# EAGLE design labwiz-module_servo_dual (EAGLE 6.5.0)

## Sheet 1 of 2
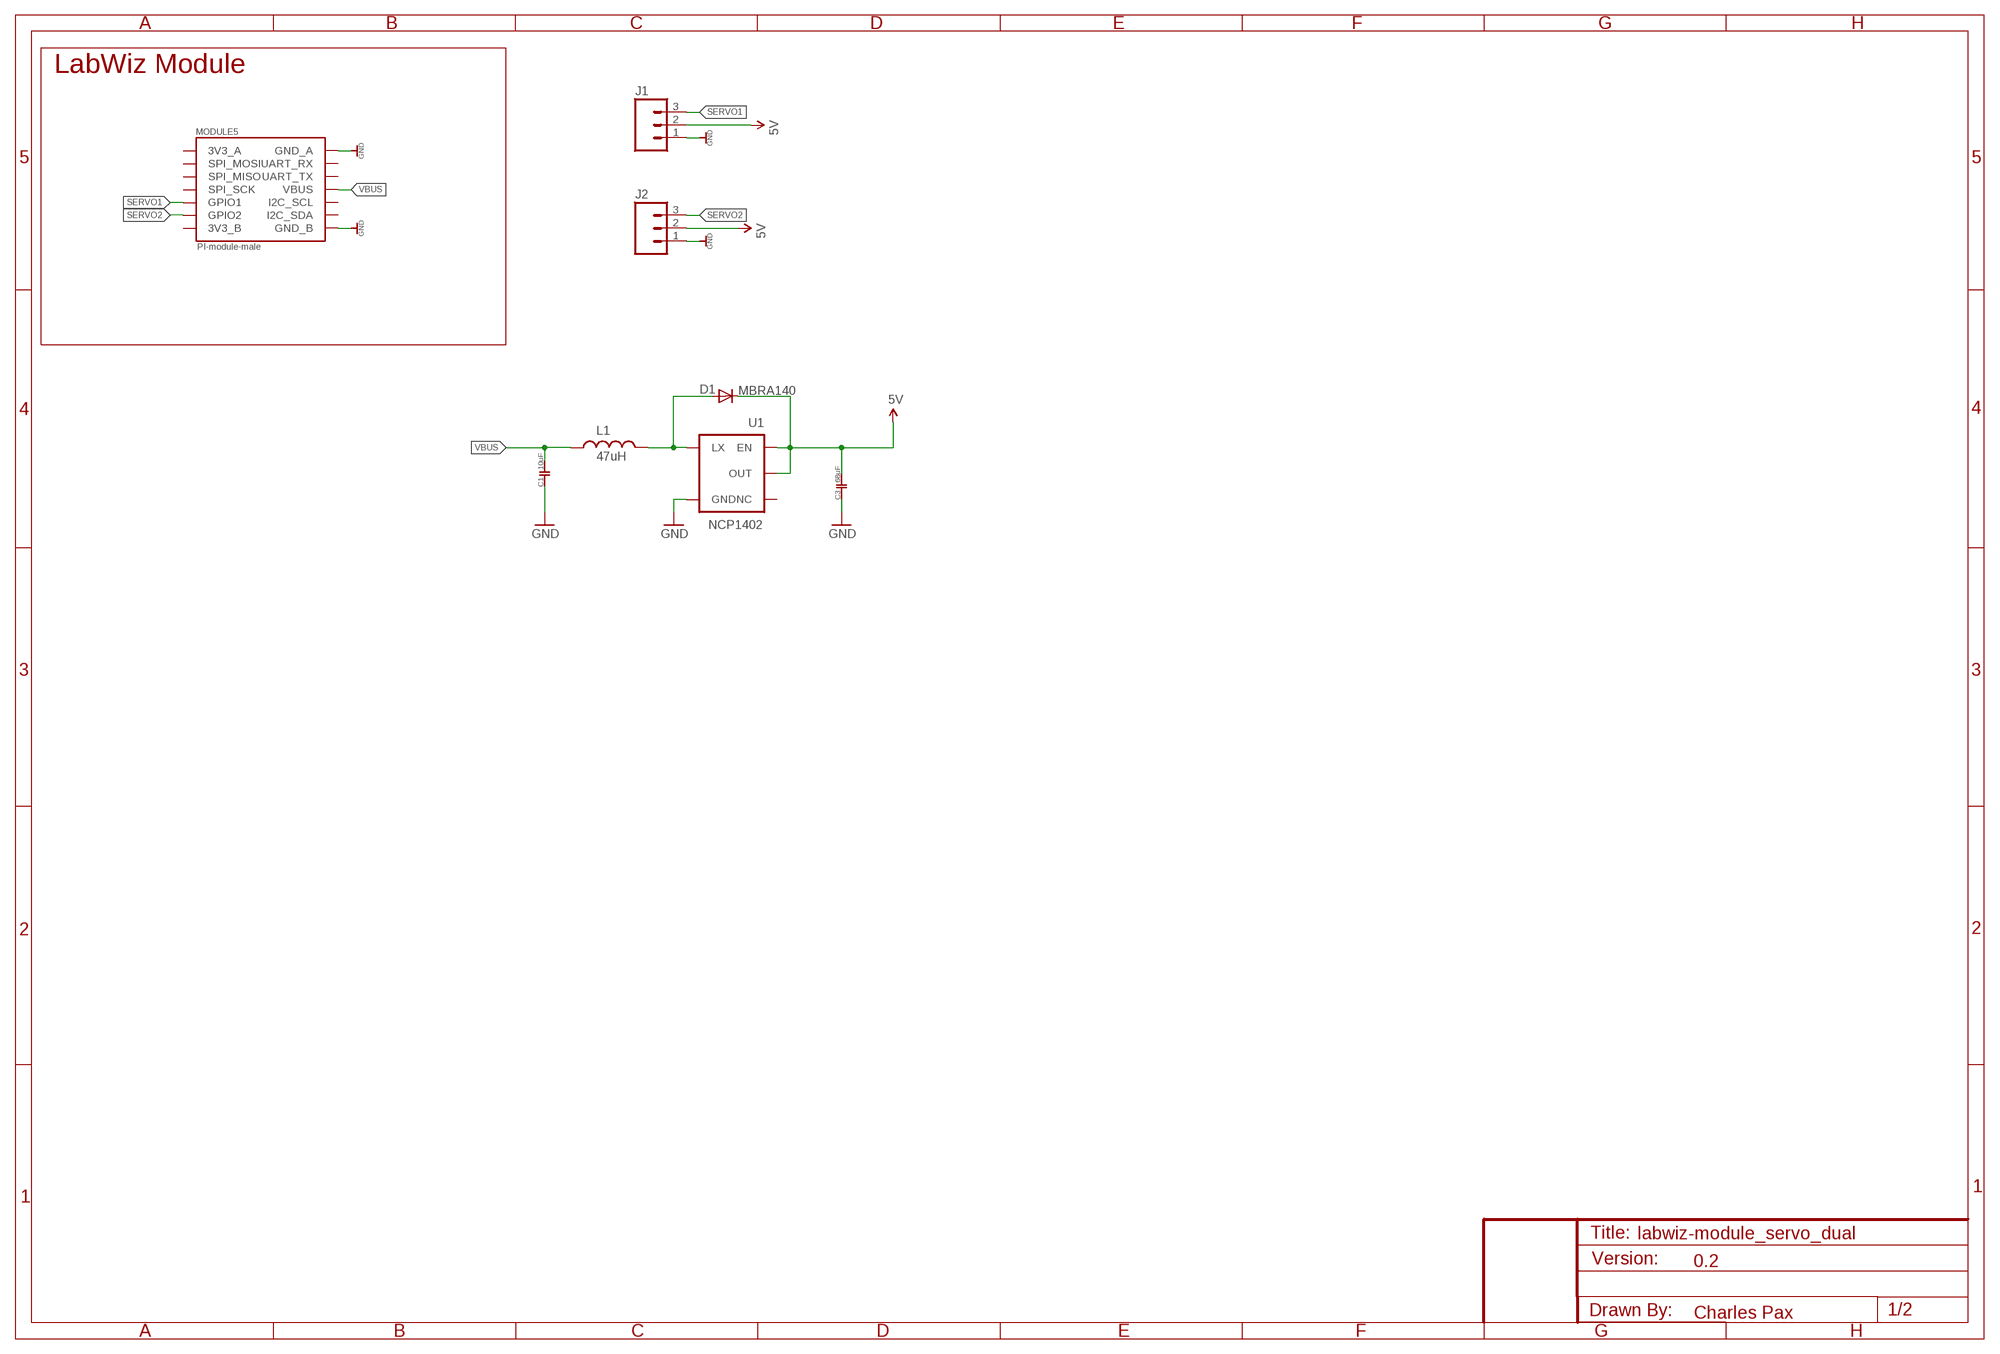
[diagram p0: schematic, sheet 1]

### Parts
C1  10uF  CAPACITOR_FIXED_10UF_0603  [0603]
C3  68uF  CAPACITOR_FIXED_0603  [0603]
D1  MBRA140  DIODESMA  [SMA-DIODE]
J1  M031X03_SMD_RA_MALE_POST_SMALLEST  [1X03_SMD_RA_MALE_POST_SMALLEST]
J2  M031X03_SMD_RA_MALE_POST_SMALLEST  [1X03_SMD_RA_MALE_POST_SMALLEST]
L1  47uH  INDUCTORCR54  [CR54]
MODULE5  PI-module-male  PAX_MODULE_EDGE_MALE_MODULE  [M07X2_2MM_EDGE]
U1  NCP1402  V_REG_NCP1400SOT23-5  [SOT23-5]

### Nets
5V: C3.2 D1.C J1.2 J2.2 U1.1(EN) U1.2(OUT)
GND: C1.1 C3.1 J1.1 J2.1 MODULE5.P$2(GND_B) MODULE5.P$14(GND_A) U1.4(GND)
N$1: D1.A L1.P$2 U1.5(LX)
SERVO1: J1.3 MODULE5.P$5(GPIO1)
SERVO2: J2.3 MODULE5.P$3(GPIO2)
VBUS: C1.2 L1.P$1 MODULE5.P$8(VBUS)
Unconnected: MODULE5.P$1(3V3_B) MODULE5.P$4(I2C_SDA) MODULE5.P$6(I2C_SCL) MODULE5.P$7(SPI_SCK) MODULE5.P$9(SPI_MISO) MODULE5.P$10(UART_TX) MODULE5.P$11(SPI_MOSI) MODULE5.P$12(UART_RX) U1.3(NC)

### Notes on the sheet
- LabWiz Module
- 0.2
- Charles Pax

## Sheet 2 of 2

## Power pins joined to a net without a drawn wire
3V3_A: MODULE5.P$13(3V3_A)

## Library data of the parts
C1 C3 = PaxInstruments-RCL:CAPACITOR_FIXED: Capacitor
D1 = SparkFun:DIODE: Diode These are standard reverse protection diodes and small signal diodes. SMA package can handle up to about 1A. SOD-323 can handle about 200mA. What the SOD-323 package when ordering, there are some mfgs out there that are 5-pin packages.
J1 J2 = SparkFun-Connectors:M03: Header 3 Standard 3-pin 0.1" header. Use with straight break away headers (SKU : PRT-00116), right angle break away headers (PRT-00553), swiss pins (PRT-00743), machine pins (PRT-00117), and female headers (PRT-00115). Molex polarized connector foot print use with SKU : PRT-08232 with associated crimp pins and housings.
L1 = SparkFun:INDUCTOR: Inductors Basic Inductor/Choke - 0603 and 1206. Footprints are not proven and vary greatly between part numbers.
MODULE5 = PaxInstruments-Connectors:PAX_MODULE; MF: Pax Instruments; MPN: PIxxxx
U1 = SparkFun:V_REG_NCP1400: Switching step-up voltage regulator NCP1400 switiching regulator takes single cell AA and outputs 100mA at 3.3V or 5V with minimal number of external components.

## Net classes
0 Digital signal: width 0.1 mm, drill 0.2 mm, clearance 0.15 mm
1 3.3V power: width 0.1 mm, drill 0.2 mm, clearance 0.15 mm
2 RTC battery: width 0.1 mm, drill 0.2 mm, clearance 0.15 mm
3 5V power: width 0.1 mm, drill 0.2 mm, clearance 0.15 mm
4 Analog signal: width 0.1 mm, drill 0.2 mm, clearance 0.15 mm
5 GND: width 0.1 mm, drill 0.2 mm, clearance 0.15 mm

## Board
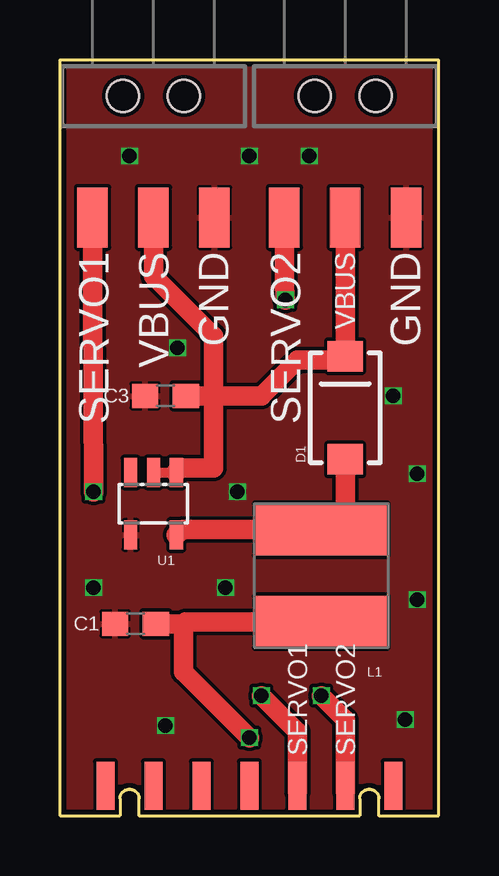
[diagram p1: board, top side]
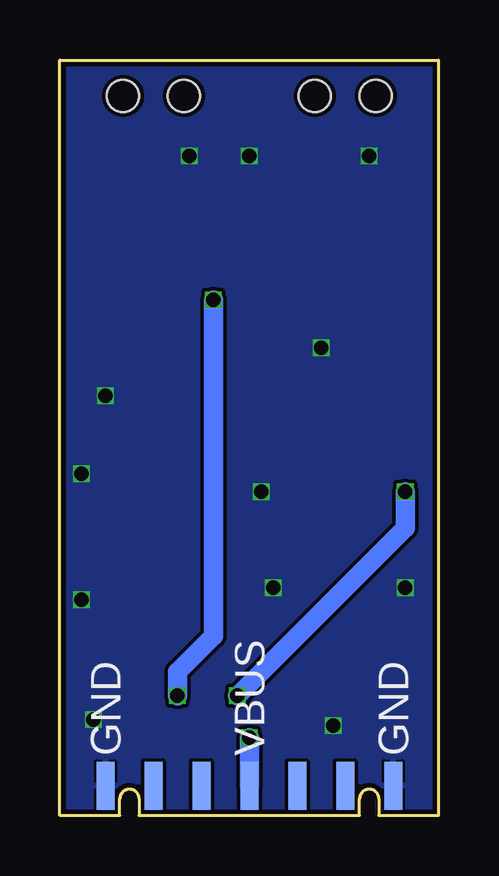
[diagram p2: board, bottom side, seen from below]

Size 15.8 x 31.5 mm. Coordinates in mm from the lower left corner, seen from the top.
Outline: 0,0 0,31.5 15.8,31.5 15.8,0 13.3,0 13.3,0.7 arc180 12.5,0.7 12.5,0 3.3,0 3.3,0.7 arc180 2.5,0.7 2.5,0 0,0
Copper layers (1*2+15*16): Top 0.017mm / dielectric 0.5mm / GND 0.017mm / dielectric 0.075mm / 3.3V 0.017mm / dielectric 0.5mm / Bottom 0.017mm
Design rules "PaxInstrument-T400 *": minimum track width 0.1mm, minimum drill 0.2mm, track to track 0.075mm, track to pad 0.075mm, pad to pad 0.075mm, via to via 0.075mm, smd to smd 0.075mm, copper to edge 0.2mm, drill to drill 0.2mm, minimum pad ring 0.5mm, minimum via ring 0.05mm, stop-mask expansion 0.01mm, vias tented up to drill 0.25mm, thermal gap 0.1mm

### Footprints (pad centres in the part's own frame; a part is rotated, then mirrored left to right if it is on the bottom)
0603 = smd 1.1 x 1: 1 -0.85,0; 2 0.85,0
SMA-DIODE = smd 1.27 x 1.47: A -2.15,0; C 2.15,0
1X03_SMD_RA_MALE_POST_SMALLEST = smd 1.27 x 2.5: 1 -2.54,5.07; 2 0,5.07; 3 2.54,5.07 | hole 1.346: -1.27,0; 1.27,0
CR54 = smd 5.5 x 2.15: P$1 0,1.92; P$2 0,-1.92
M07X2_2MM_EDGE = smd 0.75 x 2: P$1 0,-0.25; P$3 2,-0.25; P$5 4,-0.25; P$7 6,-0.25; P$9 8,-0.25; P$11 10,-0.25; P$13 12,-0.25 | smd 0.75 x 2 bottom: P$2 0,-0.25; P$4 2,-0.25; P$6 4,-0.25; P$8 6,-0.25; P$10 8,-0.25; P$12 10,-0.25; P$14 12,-0.25
SOT23-5 = smd 0.55 x 1.2: 1 -0.95,-1.3; 2 0,-1.3; 3 0.95,-1.3; 4 0.95,1.3; 5 -0.95,1.3

### Placement (x,y rotation side)
C1  3.15,8 0 top
C3  4.4,17.5 0 top
D1  11.9,17 90 top
J1  3.9,30 180 top
J2  11.9,30 180 top
L1  10.9,10 180 top
MODULE5  13.9,1 180 top
U1  3.9,13 180 top

### Tracks (layer width: path | path; a pad name or v marks a point on that pad's centre or on a via)
5V
  Top 0.406: U1.2 U1.1
  Top 0.813: J1.2 3.9,22.5 6.4,20 6.4,17.5 | 11.9,25 J2.2 D1.C 11.75,19 9.9,19 8.4,17.5 6.65,17.5 6.4,17.25 | U1.1 5.05,14.5 6.4,14.5 6.4,17.25 | 6.4,17.5 6.4,17.25 | C3.2 6.4,17.5
GND  (via drill 0.6)
  other vias: 2.9,27.5 10.4,27.5 7.9,27.5 4.9,19.5 7.4,13.5 6.9,9.5 4.4,3.75 1.4,9.5 13.9,17.5 14.9,14.25 14.4,4 14.9,9
  pour Bottom: -0.1,31.5 -0.1,0 15.9,0 15.9,31.5
  pour Top: 15.9,31.5 15.9,0 -0.1,0 -0.1,31.5
N$1
  Top 0.813: D1.A 11.9,11.85 L1.P$2 5.13,11.92 U1.5
SERVO1  (via drill 0.6)
  Top 0.813: v8.4,5 9.9,3.5 9.9,3 MODULE5.P$5 9.9,1 | v1.4,13.5 1.36,21.54 J1.3
  Bottom 0.813: v8.4,5 1.4,12 v1.4,13.5
SERVO2  (via drill 0.6)
  Top 0.813: 11.9,1 MODULE5.P$3 11.9,3 11.9,4 v10.9,5 | v9.4,21.5 9.36,22.04 J2.3
  Bottom 0.813: v10.9,5 10.9,6 9.4,7.5 v9.4,21.5
VBUS  (via drill 0.6)
  Top 0.813: L1.P$1 5.23,8.08 5.15,8 | v7.9,3.25 5.15,6 5.15,8 | 5.15,8 C1.2
  Bottom 0.813: v7.9,3.25 MODULE5.P$8

### Text on the board
tPlace: SERVO1 | VBUS | GND | SERVO2 | VBUS | GND | SERVO1 | SERVO2
bPlace: GND | VBUS | GND